# Altium schematic sheet Sheet1.SchDoc
size A4; SheetNumber: 1; SheetTotal: 1
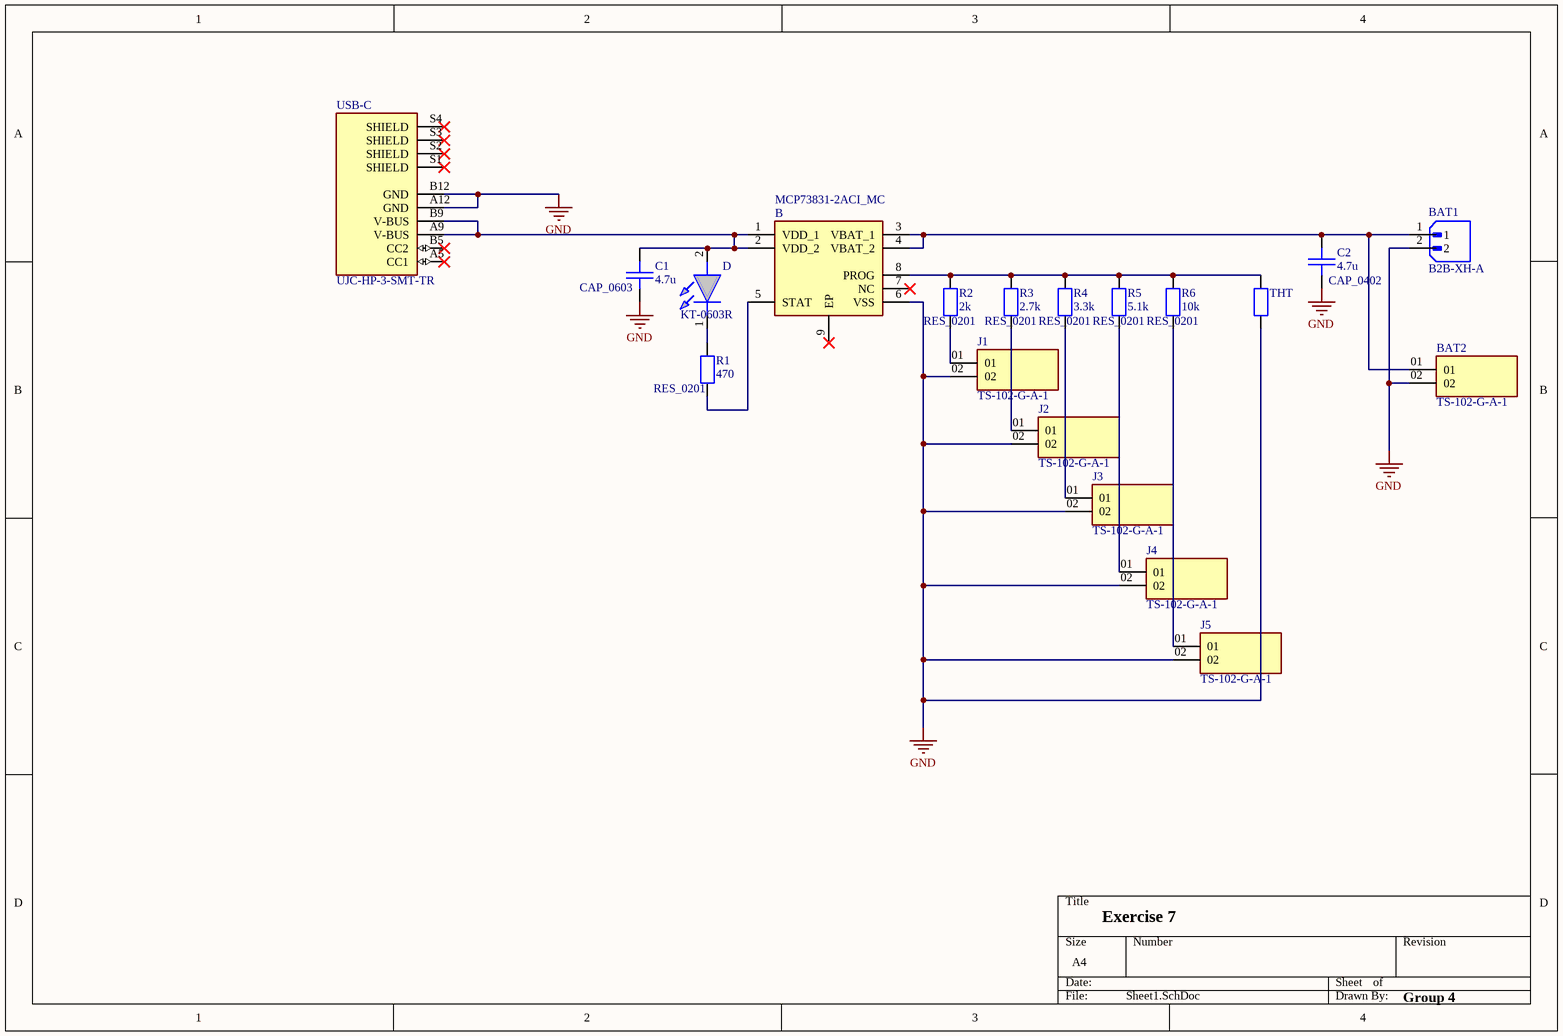
[diagram p0: Sheet1.SchDoc]

## Parts
B  MCP73831-2ACI_MC  [SON50P300X200X100-9N-D]
BAT1  B2B-XH-A  [JST_B2B-XH-A]
BAT2  TS-102-G-A-1  [SAMTEC_TS-102-G-A-1]
C1  CAP_0603  value 4.7u  [CAP_0603]
C2  CAP_0402  value 4.7u  [CAP_0402]
D  KT-0603R  [LEDC1608X70N]
J1  TS-102-G-A-1  [SAMTEC_TS-102-G-A-1]
J2  TS-102-G-A-1  [SAMTEC_TS-102-G-A-1]
J3  TS-102-G-A-1  [SAMTEC_TS-102-G-A-1]
J4  TS-102-G-A-1  [SAMTEC_TS-102-G-A-1]
J5  TS-102-G-A-1  [SAMTEC_TS-102-G-A-1]
R1  RES_0201  value 470  [RES_0201]
R2  RES_0201  value 2k  [RES_0201]
R3  RES_0201  value 2.7k  [RES_0201]
R4  RES_0201  value 3.3k  [RES_0201]
R5  RES_0201  value 5.1k  [RES_0201]
R6  RES_0201  value 10k  [RES_0201]
THT  (no value)  [PCBComponent_1]
USB-C  UJC-HP-3-SMT-TR  [CUI_UJC-HP-3-SMT-TR]

## Nets
GND: B.6(VSS) BAT1.2 BAT2.02 C1.1 C2.1 J1.02 J2.02 J3.02 J4.02 J5.02 THT.1 USB-C.A12(GND) USB-C.B12(GND)
NetB_1: B.1(VDD_1) B.2(VDD_2) C1.2 D.2(A) USB-C.A9(V-BUS) USB-C.B9(V-BUS)
NetB_3: B.3(VBAT_1) B.4(VBAT_2) BAT1.1 BAT2.01 C2.2
NetB_5: B.5(STAT) R1.1
NetB_8: B.8(PROG) R2.2 R3.2 R4.2 R5.2 R6.2 THT.2
NetD_1: D.1(K) R1.2
NetJ1_01: J1.01 R2.1
NetJ2_01: J2.01 R3.1
NetJ3_01: J3.01 R4.1
NetJ4_01: J4.01 R5.1
NetJ5_01: J5.01 R6.1

Not connected (* = marked no-connect by the designer): B 7(NC)* 9(EP)*; USB-C A5(CC1)* B5(CC2)* S1(SHIELD)* S2(SHIELD)* S3(SHIELD)* S4(SHIELD)*

## Notes on the sheet
- Exercise 7
- Group 4

## Library data of the parts
B = MCP73831-2ACI_MC: Microchip MCP73831-2ACI/MC, Battery Charge Controller Lithium-Ion, Lithium-Polymer, 8-pin DFN; Geometry.Height: 1mm; Manufacturer_Name: Microchip; Manufacturer_Part_Number: MCP73831-2ACI/MC; Mouser Part Number: 579-MCP73831-2ACI/MC; Mouser Price/Stock: https://www.mouser.co.uk/ProductDetail/Microchip-Technology/MCP73831-2ACI-MC?qs=hH%252BOa0VZEiBneYTVdpuVdg%3D%3D; Arrow Part Number: MCP73831-2ACI/MC; Arrow Price/Stock: https://www.arrow.com/en/products/mcp73831-2acimc/microchip-technology?region=nac; Datasheet Link: https://datasheet.datasheetarchive.com/originals/distributors/SFDatasheet-4/sf-00090108.pdf
BAT1 = B2B-XH-A: MF: {'manufacturer': u'JST Sales America Inc.'}; Package: None; Price: None; Value: *; MP: B2B-XH-A; Availability: Unavailable
BAT2 = TS-102-G-A-1: MF: {'manufacturer': u'Samtec Inc.'}; Package: None; Price: None; Value: *; MP: TS-102-G-A-1; Availability: Unavailable
D = KT-0603R: Red 615~630nm 1.9~2.2V 0603 Light Emitting Diodes (LED) RoHS; Manufacturer_Name: Hubei KENTO Elec; Geometry.Height: 0.7mm; Manufacturer_Part_Number: KT-0603R; Mouser Part Number: *; Mouser Price/Stock: *; Arrow Part Number: *; Arrow Price/Stock: *; Datasheet Link: https://datasheet.lcsc.com/szlcsc/Hubei-KENTO-Elec-KT-0603R_C2286.pdf
J1-J5 = CMP-002-000000-1: MF: {'manufacturer': u'Samtec Inc.'}; MP: TS-102-G-A-1; Pin Count: 2; Source: TS-102-G-A-1.SchLib; Design Item ID: TS-102-G-A-1; Availability: Unavailable; Value: *; Component Type: Standard; Price: None; Package: None
THT = R_THT
C1 = CAP_0603: LCSC: *; Tolerance: *; Voltage Rating: *; Capacitor Type: *
C2 = CAP_0402: LCSC: *; Tolerance: *; Voltage Rating: *; Capacitor Type: *
R1-R6 = RES_0201: LCSC: *; Tolerance: *; Voltage Rating: *
USB-C = UJC-HP-3-SMT-TR: Package: None; Price: None; Value: *; MP: UJC-HP-3-SMT-TR; Availability: Unavailable